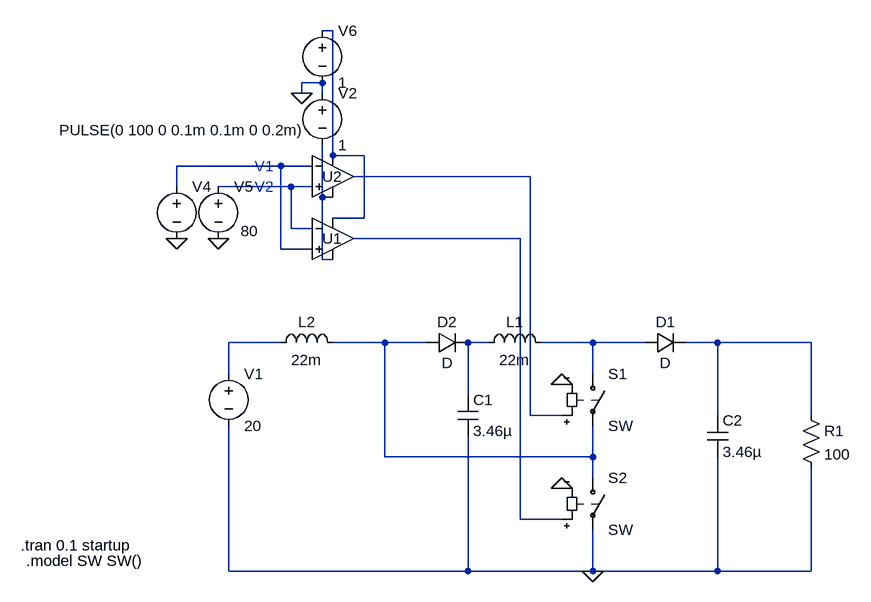
[diagram p0: schematic BoostconverterE.asc]
BoostconverterE.asc, the LTspice schematic file:
Version 4
SHEET 1 1428 680
WIRE -272 -400 -288 -400
WIRE -288 -320 -320 -320
WIRE -320 -304 -320 -320
WIRE -288 -304 -288 -320
WIRE -272 -208 -272 -400
WIRE -224 -208 -272 -208
WIRE -352 -192 -512 -192
WIRE -304 -192 -352 -192
WIRE 32 -176 -240 -176
WIRE -512 -160 -512 -192
WIRE -336 -160 -448 -160
WIRE -304 -160 -336 -160
WIRE -288 -144 -288 -224
WIRE -272 -144 -288 -144
WIRE -224 -112 -224 -208
WIRE -224 -112 -272 -112
WIRE -336 -96 -336 -160
WIRE -304 -96 -336 -96
WIRE 16 -80 -240 -80
WIRE -352 -64 -352 -192
WIRE -304 -64 -352 -64
WIRE -288 -48 -288 -144
WIRE -272 -48 -288 -48
WIRE -352 80 -432 80
WIRE -192 80 -272 80
WIRE -128 80 -192 80
WIRE -32 80 -64 80
WIRE 128 80 48 80
WIRE 208 80 128 80
WIRE 320 80 272 80
WIRE 464 80 320 80
WIRE -432 128 -432 80
WIRE 128 128 128 80
WIRE -64 160 -64 80
WIRE 32 192 32 -176
WIRE 80 192 32 192
WIRE 320 192 320 80
WIRE 464 192 464 80
WIRE -192 256 -192 80
WIRE 128 256 128 208
WIRE 128 256 -192 256
WIRE 128 288 128 256
WIRE 16 352 16 -80
WIRE 80 352 16 352
WIRE -432 432 -432 208
WIRE -64 432 -64 224
WIRE -64 432 -432 432
WIRE 128 432 128 368
WIRE 128 432 -64 432
WIRE 320 432 320 256
WIRE 320 432 128 432
WIRE 464 432 464 272
WIRE 464 432 320 432
FLAG -512 -80 0
FLAG -448 -80 0
FLAG -320 -304 0
FLAG 128 432 0
FLAG 80 304 0
FLAG 80 144 0
SYMBOL voltage -432 112 R0
WINDOW 123 0 0 Left 2
WINDOW 39 0 0 Left 2
SYMATTR InstName V1
SYMATTR Value 20
SYMBOL res 448 176 R0
SYMATTR InstName R1
SYMATTR Value 100
SYMBOL cap -80 160 R0
SYMATTR InstName C1
SYMATTR Value 3.46µ
SYMBOL ind -48 96 R270
WINDOW 0 32 56 VTop 2
WINDOW 3 5 56 VBottom 2
SYMATTR InstName L1
SYMATTR Value 22m
SYMBOL diode 208 96 R270
WINDOW 0 32 32 VTop 2
WINDOW 3 0 32 VBottom 2
SYMATTR InstName D1
SYMBOL sw 128 112 R0
SYMATTR InstName S1
SYMBOL Opamps\\UniversalOpamp2 -272 -176 R0
WINDOW 0 -16 0 Left 2
SYMATTR InstName U2
SYMBOL voltage -512 -176 R0
WINDOW 3 -181 -71 Left 2
WINDOW 123 0 0 Left 2
WINDOW 39 0 0 Left 2
SYMATTR Value PULSE(0 100 0 0.1m 0.1m 0 0.2m)
SYMATTR InstName V4
SYMBOL voltage -448 -176 R0
WINDOW 123 0 0 Left 2
WINDOW 39 0 0 Left 2
WINDOW 3 34 84 Left 2
SYMATTR Value 80
SYMATTR InstName V5
SYMBOL voltage -288 -416 R0
WINDOW 123 0 0 Left 2
WINDOW 39 0 0 Left 2
SYMATTR InstName V6
SYMATTR Value 1
SYMBOL voltage -288 -320 R0
WINDOW 123 0 0 Left 2
WINDOW 39 0 0 Left 2
SYMATTR InstName V2
SYMATTR Value 1
SYMBOL sw 128 272 R0
SYMATTR InstName S2
SYMBOL cap 304 192 R0
SYMATTR InstName C2
SYMATTR Value 3.46µ
SYMBOL Opamps\\UniversalOpamp2 -272 -80 R0
WINDOW 0 -16 0 Left 2
SYMATTR InstName U1
SYMBOL ind -368 96 R270
WINDOW 0 32 56 VTop 2
WINDOW 3 5 56 VBottom 2
SYMATTR InstName L2
SYMATTR Value 22m
SYMBOL diode -128 96 R270
WINDOW 0 32 32 VTop 2
WINDOW 3 0 32 VBottom 2
SYMATTR InstName D2
TEXT -392 -192 Left 2 ;V1
TEXT -392 -160 Left 2 ;V2
TEXT -752 392 Left 2 !.tran 0.1 startup
TEXT -744 416 Left 2 !.model SW SW()

The netlist it stands for:
* BoostconverterE.asc
V1 N007 0 20
R1 N011 0 100
C1 N009 0 3.46µ
L1 N009 N010 22m
D1 N010 N011 D
S1 N010 N008 N003 0 SW
XU2 N004 N002 N001 N005 N003 level.2 Avol=1Meg GBW=10Meg Slew=10Meg ilimit=25m rail=0 Vos=0 phimargin=45 en=0 enk=0 in=0 ink=0 Rin=500Meg  ; pins IN+ IN- V+ V- OUT
V4 N002 0 PULSE(0 100 0 0.1m 0.1m 0 0.2m)
V5 N004 0 80
V6 N001 0 1
V2 0 N005 1
S2 N008 0 N006 0 SW
C2 N011 0 3.46µ
XU1 N002 N004 N001 N005 N006 level.2 Avol=1Meg GBW=10Meg Slew=10Meg ilimit=25m rail=0 Vos=0 phimargin=45 en=0 enk=0 in=0 ink=0 Rin=500Meg  ; pins IN+ IN- V+ V- OUT
L2 N007 N008 22m
D2 N008 N009 D
.model D D
.lib standard.dio
* V1
* V2
.tran 0.1 startup
.model SW SW()
.lib UniversalOpamps2.sub
.backanno
.end